# EAGLE design pancake (EAGLE 5.11)
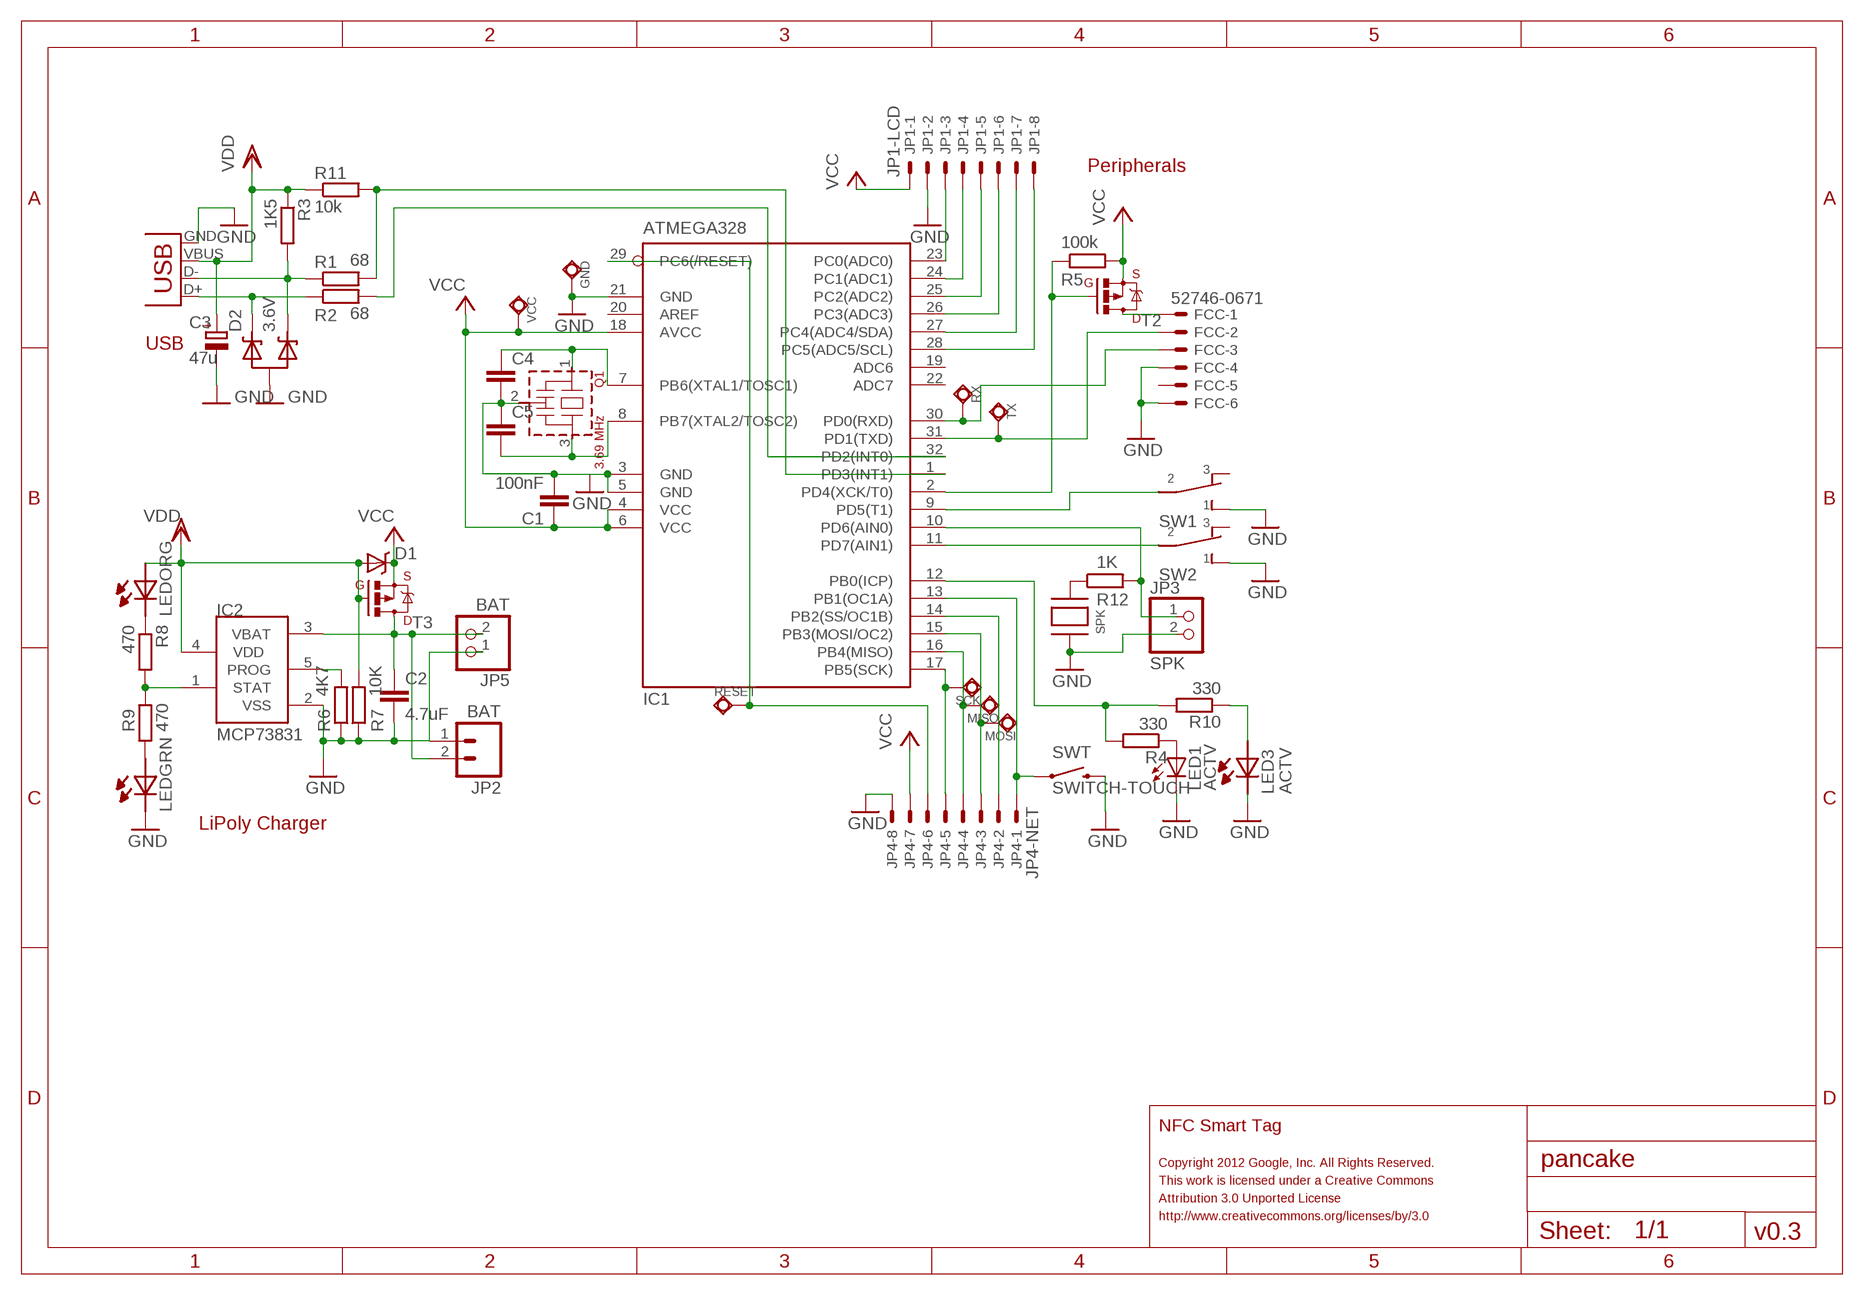
[diagram p0: schematic, sheet 1]

## Parts
C1  100nF  CAP0805  [0805]
C2  4.7uF  C-EUC0805  [C0805]
C3  47u  CPOL-EUCT6032  [CT6032]
C4  CAP0603-CAP  [0603-CAP]
C5  CAP0603-CAP  [0603-CAP]
D1  DIODE-SCHOTTKY  [MCPH3]
D2  3.6V  DIODE-ZENER-DUAL-COMMON-ANODE  [SOT23]
FCC  52746-0671  52745-0690  [52745-0690]
GND  TESTPOINT-BOTTOM  [TP_BOTTOM]
IC1  ATMEGA328  MEGA8-AI  [TQFP32-08]
IC2  MCP73831  [SOT23-5L]
JP1  JP1-LCD  53261-08  [53261-08]
JP2  BAT  M02-JST-2MM-SMT  [S2B-PH]
JP3  SPK  PINHD-1X2  [1X02]
JP4  JP4-NET  53261-08  [53261-08]
JP5  BAT  PINHD-1X2  [1X02]
LED  DUAL_LED  [SML-52]
LED1  ACTV  LEDCHIP-LED0805  [CHIP-LED0805]
LED3  ACTV  CHIPLED_REVERSE  [CHIPLED_1206_REVERSE]
MISO  TESTPOINT-BOTTOM  [TP_BOTTOM]
MOSI  TESTPOINT-BOTTOM  [TP_BOTTOM]
Q1  3.69 MHz  CTSC  [CSTCC_MG]
R1  68  R-EU_R0805  [R0805]
R2  68  R-EU_R0805  [R0805]
R3  1K5  R-EU_R0805  [R0805]
R4  330  R-EU_R0805  [R0805]
R5  100k  R-EU_R0805  [R0805]
R6  4K7  R-EU_R0805  [R0805]
R7  10K  R-EU_R0805  [R0805]
R8  470  R-EU_R0805  [R0805]
R9  470  R-EU_R0805  [R0805]
R10  330  R-EU_R0805  [R0805]
R11  10k  R-EU_R0805  [R0805]
R12  1K  R-EU_R0805  [R0805]
RESET  TESTPOINT-BOTTOM  [TP_BOTTOM]
RX  TESTPOINT-BOTTOM  [TP_BOTTOM]
SCK  TESTPOINT-BOTTOM  [TP_BOTTOM]
SPK  MURATA_BUZZER_SMD  [PKLCS1212]
SW1  SWITCH-CUS-12B  [CUS-12B]
SW2  SWITCH-CUS-12B  [CUS-12B]
SWT  SWITCH-TOUCH  [SWITCH-EVQ11]
T2  MOSFET-PCHANNEL  [SOT23]
T3  MOSFET-PCHANNEL  [SOT23]
TX  TESTPOINT-BOTTOM  [TP_BOTTOM]
USB  USB-MICROB  [USB-MICROB]
VCC  TESTPOINT-BOTTOM  [TP_BOTTOM]

## Nets
D+: D2.2(C2) R2.1 USB.D+
D-: D2.1(C1) R1.1 R3.2 USB.D-
GND: C1.2 C2.2 C3.- C4.2 C5.1 D2.3(A) FCC.4 FCC.6 GND.TP IC1.3(GND) IC1.5(GND) IC1.21(GND) IC2.2(VSS) JP1.2 JP2.1 JP3.2 JP4.8 JP5.1 LED1.C LED3.C(CATHODE) LED.C_GRN(GRN:CATHODE) Q1.2(VSS) R6.1 R7.1 SPK.P$1 SW1.1 SW2.1 SWT.P2 USB.GND
N$1: LED.C_ORG(ORG:CATHODE) R8.1
N$2: LED.A_GRN(GRN:ANODE) R9.1
N$3: FCC.1 T2.3(D)
N$4: LED3.A(ANODE) R10.1
N$5: R12.1 SPK.P$2
N$7: LED1.A R4.1
NFC_POW_CTRL: IC1.2(PD4(XCK/T0)) R5.1 T2.1(G)
PB0: IC1.12(PB0(ICP)) R4.2 R10.2
PB1: IC1.13(PB1(OC1A)) JP4.1 SWT.P1
PB2: IC1.14(PB2(SS/OC1B)) JP4.2
PB3: IC1.15(PB3(MOSI/OC2)) JP4.3 MOSI.TP
PB4: IC1.16(PB4(MISO)) JP4.4 MISO.TP
PB5: IC1.17(PB5(SCK)) JP4.5 SCK.TP
PC0: IC1.23(PC0(ADC0)) JP1.3
PC1: IC1.24(PC1(ADC1)) JP1.4
PC2: IC1.25(PC2(ADC2)) JP1.5
PC3: IC1.26(PC3(ADC3)) JP1.6
PC4: IC1.27(PC4(ADC4/SDA)) JP1.7
PC5: IC1.28(PC5(ADC5/SCL)) JP1.8
PD2: IC1.32(PD2(INT0)) R2.2
PD3: IC1.1(PD3(INT1)) R1.2 R11.2
PD5: IC1.9(PD5(T1)) SW1.2
PD6: IC1.10(PD6(AIN0)) JP3.1 R12.2
PD7: IC1.11(PD7(AIN1)) SW2.2
PROG: IC2.5(PROG) R6.2
RESET: IC1.29(PC6(/RESET)) JP4.6 RESET.TP
RX: FCC.3 IC1.30(PD0(RXD)) RX.TP
STAT: IC2.1(STAT) R8.2 R9.2
TX: FCC.2 IC1.31(PD1(TXD)) TX.TP
VBAT: C2.1 IC2.3(VBAT) JP2.2 JP5.2 T3.3(D)
VCC: C1.1 D1.3(C) IC1.4(VCC) IC1.6(VCC) IC1.18(AVCC) JP1.1 JP4.7 R5.2 T2.2(S) T3.2(S) VCC.TP
VDD: C3.+ D1.1(A) IC2.4(VDD) LED.A_ORG(ORG:ANODE) R3.1 R7.2 R11.1 T3.1(G) USB.VBUS
XTAL1: C4.1 IC1.7(PB6(XTAL1/TOSC1)) Q1.1
XTAL2: C5.2 IC1.8(PB7(XTAL2/TOSC2)) Q1.3
Unconnected: FCC.5 IC1.19(ADC6) IC1.20(AREF) IC1.22(ADC7) SW1.3 SW2.3

## Notes on the sheet
- Peripherals
- USB
- LiPoly Charger
- NFC Smart Tag
- Copyright 2012 Google, Inc. All Rights Reserved.
- This work is licensed under a Creative Commons
- Attribution 3.0 Unported License
- http://www.creativecommons.org/licenses/by/3.0
- v0.3

## Library data of the parts
C1 C4 C5 = SparkFun:CAP: Capacitor Standard 0603 ceramic capacitor, and 0.1" leaded capacitor.
C2 = resistor:C-EU: CAPACITOR, European symbol
C3 = rcl:CPOL-EU: POLARIZED CAPACITOR, European symbol
D1 = sandwich:DIODE-SCHOTTKY
D2 = sandwich:DIODE-ZENER-DUAL-COMMON-ANODE: Dual Zener diode in SOT-23 Package. e.g. AZ23C
FCC = con-molex:52745-0690: FFC/FPC-to-Board 0.50mm (.020") SMT Top Contact Right Angle, ZIF, Style Receptacle 52745 / 52435 Source: http://www.molex.com/product/ffc/52745.html; MPN: 52745-0690; OC_FARNELL: unknown; OC_NEWARK: 92M6374
GND MISO MOSI RESET RX SCK TX VCC = sandwich:TESTPOINT-BOTTOM: Round test point on bototm layer. 1.5mm diameter
IC1 = atmel:MEGA8: MICROCONTROLLER 8 Kbytes FLASH, 1 kbytes SRAM, 512 bytes EEPROM, USART, 6-channel 10 bit ADC, 2-channel 8 bit ADC Pin compatible with Atmega48, ATMega88, ATMega168 Source: avr.lbr; MPN: ATMEGA8-16AU; OC_FARNELL: 9171371; OC_NEWARK: 73M8863
IC2 = microchip-update-2:MCP73831: Miniature Single-Cell, Fully Integrated Li-Ion, Li-Polymer Charge Management Controllers
JP1 JP4 = con-molex:53?-08: CONNECTOR wire to board 1.25 mm (.049 inch) pitch header; OC_FARNELL: 1125376; OC_NEWARK: unknown
JP2 = SparkFun:M02: Header 2 Standard 2-pin 0.1" header. Use with straight break away headers (SKU : PRT-00116), right angle break away headers (PRT-00553), swiss pins (PRT-00743), machine pins (PRT-00117), and female headers (PRT-00115). Molex polarized connector foot print use with SKU : PRT-08233 with associated crimp pins and housings.
JP3 JP5 = pinhead:PINHD-1X2: PIN HEADER
LED = sandwich:DUAL_LED: Rohm Dual Color SML-521MDW
LED1 = led:LED: LED OSRAM: - CHIPLED LG R971, LG N971, LY N971, LG Q971, LY Q971, LO R971, LY R971 LH N974, LH R974 LS Q976, LO Q976, LY Q976 LO Q996 - Hyper CHIPLED LW Q18S LB Q993, LB Q99A, LB R99A - SideLED LS A670, LO A670, LY A670, LG A670, LP A670 LB A673, LV A673, LT A673, LW A673 LH A674 LY A675 LS A676, LA A676, LO A676, LY A676, LW A676 LS A679, LY A679, LG A679 - Hyper Micro SIDELED® LS Y876, LA Y876, LO Y876, LY Y876 LT Y87S - SmartLED LW L88C, LW L88S LB L89C, LB L89S, LG L890 LS L89K, LO L89K, LY L89K LS L896, LA L896, LO L896, LY L896 - TOPLED LS T670, LO T670, LY T670, LG T670, LP T670 LSG T670, LSP T670, LSY T670, LOP T670, LYG T670 LG T671, LOG T671, LSG T671 LB T673, LV T673, LT T673, LW T673 LH T674 LS T676, LA T676, LO T676, LY T676, LB T676, LH T676, LSB T676, LW T676 LB T67C, LV T67C, LT T67C, LS T67K, LO T67K, LY T67K, LW E67C LS E67B, LA E67B, LO E67B, LY E67B, LB E67C, LV E67C, LT E67C LW T67C LS T679, LY T679, LG T679 LS T770, LO T770, LY T770, LG T770, LP T770 LB T773, LV T773, LT T773, LW T773 LH T774 LS E675, LA E675, LY E675, LS T675 LS T776, LA T776, LO T776, LY T776, LB T776 LHGB T686 LT T68C, LB T68C - Hyper Mini TOPLED® LB M676 - Mini TOPLED Santana® LG M470 LS M47K, LO M47K, LY M47K Source: http://www.osram.convergy.de LUXEON: - LUMILED® LXK2-PW12-R00, LXK2-PW12-S00, LXK2-PW14-U00, LXK2-PW14-V00 LXK2-PM12-R00, LXK2-PM12-S00, LXK2-PM14-U00 LXK2-PE12-Q00, LXK2-PE12-R00, LXK2-PE12-S00, LXK2-PE14-T00, LXK2-PE14-U00 LXK2-PB12-K00, LXK2-PB12-L00, LXK2-PB12-M00, LXK2-PB14-N00, LXK2-PB14-P00, LXK2-PB14-Q00 LXK2-PR12-L00, LXK2-PR12-M00, LXK2-PR14-Q00, LXK2-PR14-R00 LXK2-PD12-Q00, LXK2-PD12-R00, LXK2-PD12-S00 LXK2-PH12-R00, LXK2-PH12-S00 LXK2-PL12-P00, LXK2-PL12-Q00, LXK2-PL12-R00 Source: www.luxeon.com KINGBRIGHT: KA-3528ASYC Source: www.kingbright.com
LED3 = sandwich:CHIPLED_REVERSE
Q1 = murata-resonators:CTSC: Murata Resonator 3.50 - 10.00MHz
R1-R12 = resistor:R-EU_: RESISTOR, European symbol
SPK = sandwich:MURATA_BUZZER_SMD
SW1 SW2 = sandwich:SWITCH-CUS-12B: CUS-12B 1P2T SMD Switch RS Part 602-3633
SWT = sandwich:SWITCH-TOUCH: Round Light Touch Switch, e.g. Panasonic EVQ11
T2 T3 = sandwich:MOSFET-PCHANNEL: E.g. IRLML6402
USB = sandwich:USB: USB Connectors USB-B-PTH is fully proven SKU : PRT-00139 USB-miniB is fully proven SKU : PRT-00587 USB-A-PCB is untested. USB-A-H is throughly reviewed, but untested. Spark Fun Electronics SKU : PRT-00437 USB-B-SMT is throughly reviewed, but untested. Needs silkscreen touching up. USB-A-S has not been used/tested USB-MB-H has not been used/tested

## Board
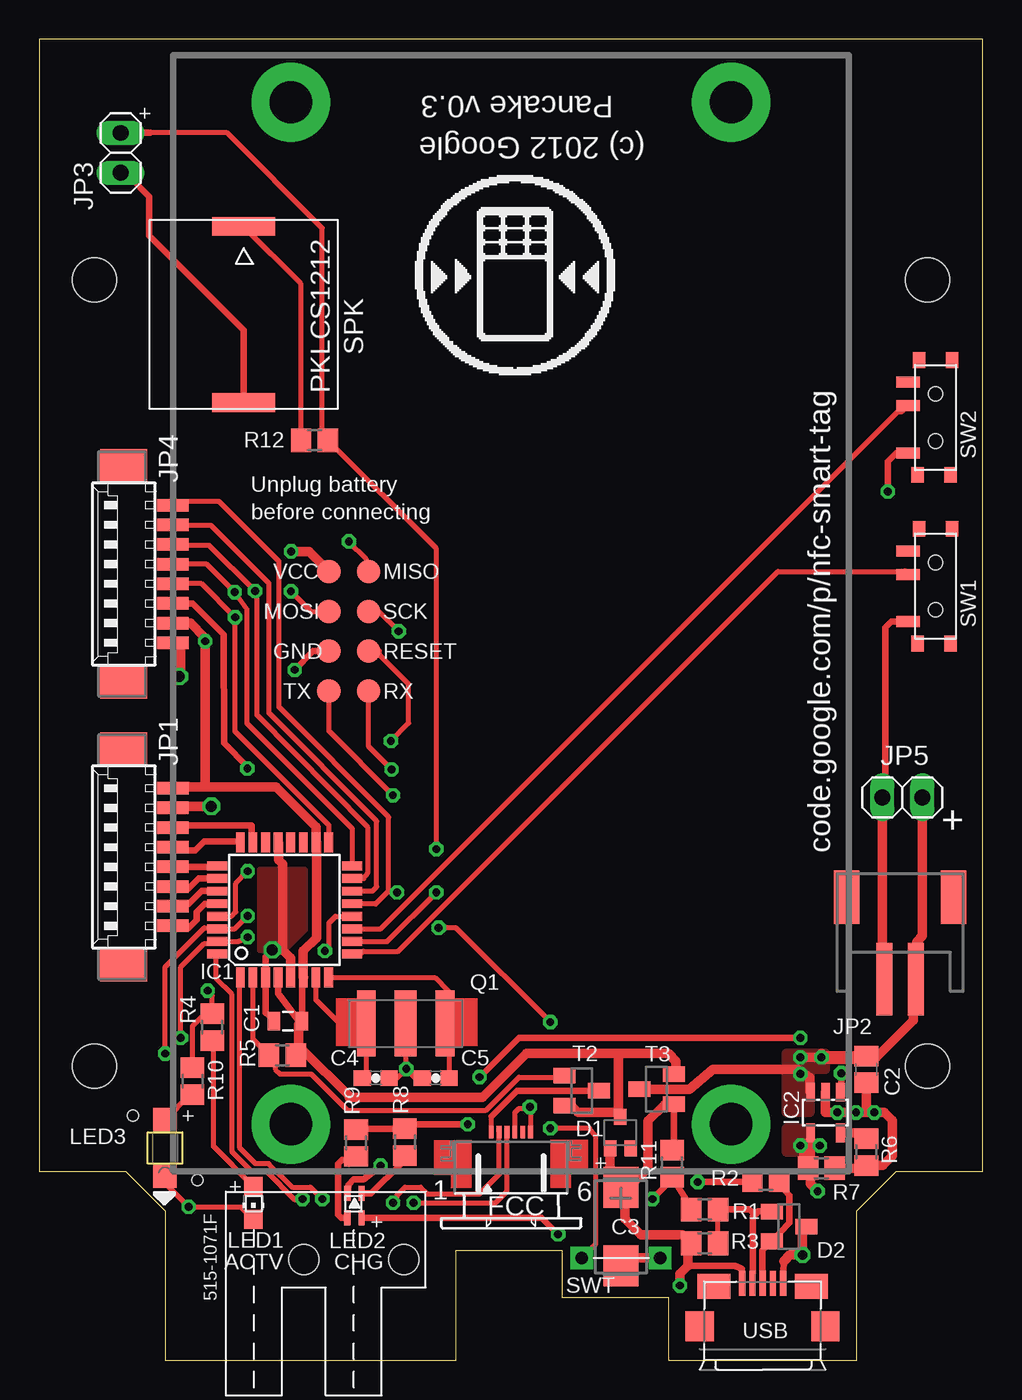
[diagram p1: board, top side]
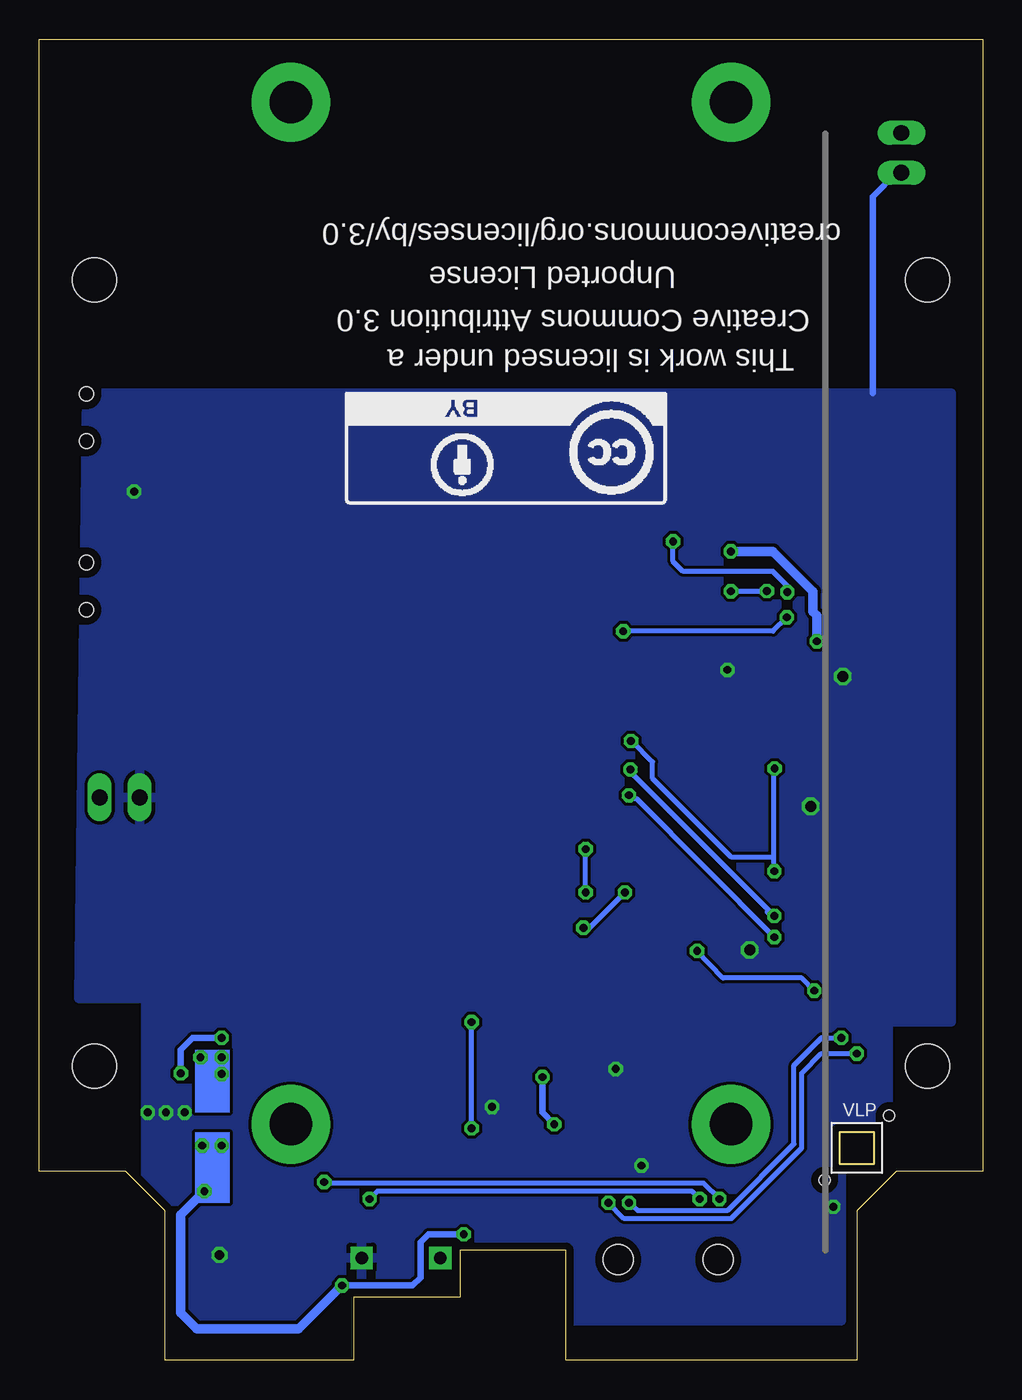
[diagram p2: board, bottom side, seen from below]

Size 60 x 84 mm. Coordinates in mm from the lower left corner, seen from the top.
Outline: 8,9.5 8,0 26.5,0 26.5,7 33.25,7 33.25,4 40,4 40,0 52,0 52,9.5 54.5,12 60,12 60,84 0,84 0,12 5.5,12 8,9.5
Copper layers (1*16): Top 0.035mm / dielectric 1.5mm / Bottom 0.035mm
Design rules "default *": minimum track width 0.3mm, minimum drill 19mil, track to track 5mil, track to pad 5mil, pad to pad 5mil, via to via 5mil, smd to smd 5mil, copper to edge 0.5mm, drill to drill 5mil, minimum pad ring 10mil, minimum via ring 8mil, stop-mask expansion 4mil, vias tented up to drill 0.5mm, thermal gap 10mil
Holes 2.8 mm at 3.5,18.7 56.5,68.7 3.5,68.7 56.5,18.7

### Footprints (pad centres in the part's own frame; a part is rotated, then mirrored left to right if it is on the bottom)
0805 = smd 0.8 x 1.2: 1 -0.9,0; 2 0.9,0
C0805 = smd 1.3 x 1.5: 1 -0.85,0; 2 0.85,0
CT6032 = smd 2.6 x 2.2: + -2.5,0; - 2.5,0
0603-CAP = smd 1.1 x 1: 1 -0.85,0; 2 0.85,0
MCPH3 = smd 0.8 x 1: 1 -0.65,-1; 2 0.65,-1; 3 0,1
SOT23 = smd 1 x 1.4: 1 -0.95,-1.1; 2 0.95,-1.1; 3 0,1.1
52745-0690 = smd 0.3 x 0.8: 1 -1.25,2.5; 2 -0.75,2.5; 3 -0.25,2.5; 4 0.25,2.5; 5 0.75,2.5; 6 1.25,2.5
TP_BOTTOM = smd 1.5 x 1.5 bottom: TP 0,0
TQFP32-08 = smd 1.27 x 0.559: 1 -4.293,2.8; 2 -4.293,2; 3 -4.293,1.2; 4 -4.293,0.4; 5 -4.293,-0.4; 6 -4.293,-1.2; 7 -4.293,-2; 8 -4.293,-2.8; 17 4.293,-2.8; 18 4.293,-2; 19 4.293,-1.2; 20 4.293,-0.4; 21 4.293,0.4; 22 4.293,1.2; 23 4.293,2; 24 4.293,2.8 | smd 0.559 x 1.27: 9 -2.8,-4.293; 10 -2,-4.293; 11 -1.2,-4.293; 12 -0.4,-4.293; 13 0.4,-4.293; 14 1.2,-4.293; 15 2,-4.293; 16 2.8,-4.293; 25 2.8,4.293; 26 2,4.293; 27 1.2,4.293; 28 0.4,4.293; 29 -0.4,4.293; 30 -1.2,4.293; 31 -2,4.293; 32 -2.8,4.293
SOT23-5L = smd 0.55 x 1.2: 1 -0.95,-1.3; 2 0,-1.3; 3 0.95,-1.3; 4 0.95,1.3; 5 -0.95,1.3
53261-08 = smd 0.8 x 2: 1 4.375,-2.5; 2 3.125,-2.5; 3 1.875,-2.5; 4 0.625,-2.5; 5 -0.625,-2.5; 6 -1.875,-2.5; 7 -3.125,-2.5; 8 -4.375,-2.5 | smd 2.1 x 3: S1 6.875,0.625; S2 -6.875,0.625
S2B-PH = smd 1 x 4.6: 1 -1,-3.7; 2 1,-3.7 | smd 1.6 x 3.4: NC1 -3.4,1.5; NC2 3.4,1.5
1X02 = drill 1.016 long: 1 -1.27,0; 2 1.27,0
SML-52 = smd 0.95 x 0.4: A_GRN 0.775,-0.45; A_ORG 0.775,0.45; C_GRN -0.775,-0.45; C_ORG -0.775,0.45
CHIP-LED0805 = smd 1.2 x 1.2: A 0,-1.05; C 0,1.05
CHIPLED_1206_REVERSE = smd 1.5 x 1.5: A 0,-1.8; C 0,1.8
CSTCC_MG = smd 1.2 x 4.2: 1 -2.5,0; 3 2.5,0 | smd 1.4 x 4.2: 2 0,0
R0805 = smd 1.3 x 1.5: 1 -0.85,0; 2 0.85,0
PKLCS1212 = smd 1.2 x 4: P$1 -5.6,0; P$2 5.6,0
CUS-12B = smd 0.7 x 1.5: 1 -2.25,1.75; 2 0.75,1.75; 3 2.25,1.75 | smd 1 x 0.8: P$1 3.65,1.05; P$2 3.65,-1.05; P$3 -3.65,1.15; P$4 -3.65,-0.95 | hole 0.9: 1.5,0; -1.5,0
SWITCH-EVQ11 = drill 0.8 pad 1.422 square: P1 -2.5,0; P2 2.5,0
515-1071F = hole 1.9: 3.175,0; -3.175,0
BIVAR_VLP = hole 0.7: 2.05,2.05; -2.05,-2.05
USB-MICROB = smd 0.4 x 1.6: D+ 0,2.9; D- -0.65,2.9; GND 1.3,2.9; ID 0.65,2.9; VBUS -1.3,2.9 | smd 2.1 x 1.6: GND@1 3.1,2.7; GND@4 -3.1,2.7 | smd 1.8 x 1.9: GND@2 -4,0.15; GND@3 4,0.15

### Placement (x,y rotation side)
C1  15.81,21.57 180 top
C2  52.6,18.5 270 top
C3  36.99,8.5 270 top
C4  21.4,17.95 0 top
C5  25.21,17.95 0 top
D1  36.95,14.47 0 top
D2  47.68,8.51 270 top
FCC  30,12 0.1 top
GND  18.41,45.09 0 bottom
IC1  15.59,28.63 90 top
IC2  50,15.75 180 top
JP1  6,32 90 top
JP2  54.75,27.94 0 top
JP3  5.17,76.78 270 top
JP4  6,50 90 top
JP5  54.9,35.8 0 top
LED  20.05,9.83 270 top
LED1  13.62,10.01 180 top
LED3  8,13.5 180 top
MISO  20.95,50.16 0 bottom
MOSI  18.41,47.62 0 bottom
Q1  23.3,21.41 0 top
R1  42.31,9.59 180 top
R2  46.2,11.46 180 top
R3  42.31,7.43 0 top
R4  11.01,21.18 90 top
R5  15.46,19.39 0 top
R6  52.6,13.24 90 top
R7  49.73,12.21 180 top
R8  23.25,13.88 90 top
R9  20.15,13.81 90 top
R10  9.75,17.75 90 top
R11  40.25,12.5 270 top
R12  17.5,58.5 0 top
RESET  20.95,45.09 0 bottom
RX  20.95,42.55 0 bottom
SCK  20.95,47.62 0 bottom
SPK  13,66.5 90 top
SW1  57,49.22 90 top
SW2  57,59.95 90 top
SWT  37,6.5 0 top
T2  34.5,17.14 270 top
T3  39.26,17.23 90 top
TX  18.41,42.55 0 bottom
U$1  [515-1071F]  20,6.4 0 top
U$2  [BIVAR_VLP]  8,13.5 0 bottom
U$3  [NFC_LOGO_100]  30.25,69 180 top
U$4  [CCBY]  30.25,57.75 180 bottom
USB  46,2 0 top
VCC  18.41,50.16 0 bottom

### Tracks (layer width: path | path; a pad name or v marks a point on that pad's centre or on a via)
D+
  Top 0.406: R2.1 47.05,11.2 47.7,10.5 47.7,8.72 D2.2 46,6.97 USB.D+
D-
  Top 0.305: R3.2 R1.1
  Top 0.406: USB.D- 45.39,6.11 45.39,9.14 45.5,9.25 | 45.5,9.25 45.7,9.46 D2.1 | R1.1 45.16,9.59 45.5,9.25
GND  (via drill 0.48, 0.5, 0.6, 0.7)
  Top 0.3: 18.52,45.09 GND.TP
  Top 0.305: JP5.1 53.91,36.08 | FCC.4 30.25,15.75 30.5,16 31.1,16 v31.2,16.1 31.25,15.65 FCC.6 | LED1.C 12.82,9.75 v9.5,9.75 8,11.25 LED3.C | C5.1 23.91,17.95 v23.34,18.52 | C4.2 22.77,17.95 v23.34,18.52 | v23.34,18.52 23.34,21.36 Q1.2 | C1.2 14.38,22.09
  Top 0.406: 15.97,24.36 IC1.5 | JP1.2 8.21,35.12 | USB.GND 47.34,6.3 | LED.C_GRN 19.66,11.16 20,11.5 20.63,11.5 v21.7,12.37 | v14.82,26.09 14.39,25.66 IC1.3 14.38,24.27 14.38,22.09 | SW2.1 54.52,57.7 53.98,57.15 v53.98,55.24 | SW1.1 54.63,46.97 54.61,46.99 54.19,46.99 53.8,46.6 53.8,35.97 JP5.1 | 18.52,45.09 17.43,45.09 v16.24,43.89 | SPK.P$1 13,65.5 7,71.5 7,74 5.75,75.25 5.42,75.25 JP3.2
  Top 0.61: v14.82,26.09 15.46,26.09 | 15.46,26.09 15.97,25.58 15.97,24.36 | 15.46,26.09 15.46,31.55 15.21,31.8 15.21,32.9 IC1.21 | IC2.2 50,15.75 v51.95,15.75 52.5,15.75 | JP5.1 53.63,24.86 JP2.1 | JP4.8 8.88,45.62 9,45.5 9,43.58 v8.9,43.48 | JP1.2 8.6,35.23 v10.94,35.23 | v53.12,15.75 52.85,15.77 | v53.12,15.75 52.5,15.75 | R6.1 52.6,12.1 | R6.1 53.64,12.39 54.25,13 54.25,15.25 53.75,15.75 v53.12,15.75 | R6.1 52.51,12.3 | D2.3 48.53,8.26 v48.53,6.7 47.73,6.7 47.34,6.3 | C3.- 37.76,6.5 SWT.P2 | R7.1 52.41,12.21 R6.1 | C2.2 52.6,15.85 52.5,15.75
  Bottom 0.406: JP3.2 5.5,75.5 7,74 7,61.5
  other vias: 50.75,15.75
  pour Bottom (isolate 0.2): 53.25,2.5 53.25,23 57.5,23 57,61.5 2,61.5 2,21.5 6,21.5 6,12.5 8.98,12.5 9,3.42 9,2.5
  pour Top: 14.05,31.17 16.86,31.17 16.86,27.36 15.59,26.09 14.05,26.09
N$1
  Top 0.406: LED.C_ORG 21.11,10.61 23,12.5 23,12.78 R8.1
N$2
  Top 0.406: R9.1 19.71,12.5 19.46,12.75 19.25,12.75 19,12.5 19,9.25 19.19,9.06 LED.A_GRN
N$3
  Top 0.305: FCC.1 28.75,15.5
  Top 0.406: T2.3 30.39,17.14 28.75,15.5
N$4
  Top 0.305: R10.1 9.6,16.9 LED3.A
N$5
  Top 0.305: R12.1 16.65,68.45 SPK.P$2
N$7
  Top 0.305: R4.1 11.09,20.25 11.09,13.59 LED1.A
NFC_MOUNT1  (via drill 2.7 pad 5)
  other vias: 16,80
NFC_MOUNT2  (via drill 2.7 pad 5)
  other vias: 44,80
NFC_MOUNT3  (via drill 2.7 pad 5)
  other vias: 44,15
NFC_MOUNT4  (via drill 2.7 pad 5)
  other vias: 16,15
NFC_POW_CTRL
  Top 0.305: T2.1 33.81,18 30.5,18 28.4,15.9 19.6,15.9 17.3,18.2 15.3,18.2 15,18.5 15,19 R5.1 13.59,20.41 IC1.2
  Top 0.406: IC1.2 13.6,24.33
PB0  (via drill 0.5)
  Top 0.305: IC1.12 18.84,28.23 18.41,27.8 18.41,26.28 v18.16,26.03 | v10.7,23.5 11.01,23.2 R4.2 10.53,22.03 9.75,21.25 R10.2
  Bottom 0.305: v18.16,26.03 16.51,24.3 11.51,24.3 v10.7,23.5
PB1  (via drill 0.5)
  Top 0.3: 8.53,54.25 JP4.1
  Top 0.305: IC1.13 19.91,29.06 | 8.53,54.25 8.89,54.61 11.43,54.61 15.24,50.8 15.24,41.53 22.23,34.54 22.23,29.84 | 20.12,29.01 21.39,29.01 22.23,29.84 | v32.5,14.75 35,14.75 35.4,14.25 35.4,7.4 SWT.P1 | v32.5,21.5 26.5,27.5 v25.4,27.5 | v22.75,29.75 22.32,29.75 22.23,29.84
  Top 0.406: 20.12,29.01 IC1.13
  Bottom 0.3: v25.4,27.5 25.4,27.64 25.2,27.64 25.2,27.5
  Bottom 0.305: v32.5,14.75 v32.5,21.5 | 25.25,27.5 25.2,27.5 25,27.5 v22.75,29.75
PB2
  Top 0.3: JP4.2 8.53,53.03
  Top 0.305: JP4.2 8.54,53.09 10.92,53.09 14.61,49.4 14.61,41.15 21.46,34.29 21.46,30.1 21.19,29.83 IC1.14
PB3  (via drill 0.5)
  Top 0.305: JP4.3 8.56,51.82 10.81,51.82 v13.72,48.91 13.84,48.39 13.84,41.02 20.9,33.86 20.9,31 20.63,30.63 IC1.15 | MOSI.TP 17.27,47.62 v16,48.9
  Bottom 0.305: v16,48.9 13.73,48.9 v13.72,48.91
PB4  (via drill 0.5)
  Top 0.3: MISO.TP 20.95,49.96 | IC1.16 19.91,31.57
  Top 0.305: MISO.TP 20.78,50.34 20.78,50.98 v19.68,52.07 | 19.91,31.57 19.91,33.79 13.21,40.5 13.21,47.75 v12.42,48.84 10.63,50.62 JP4.4
  Bottom 0.305: v19.68,52.07 19.68,50.8 19.05,50.16 13.34,50.16 12.32,49.15 v12.42,48.84
PB5  (via drill 0.5)
  Top 0.3: 8.53,49.38 JP4.5
  Top 0.305: 8.53,49.38 10.31,49.38 v12.45,47.24 12.45,39.99 18.41,34.02 18.41,32.95 IC1.17 | SCK.TP 21.59,47.62 v22.86,46.35
  Bottom 0.305: v12.45,47.24 13.34,46.35 v22.86,46.35
PC0
  Top 0.406: JP1.3 8.62,34 13.5,34 13.5,33.01 IC1.23
PC1
  Top 0.406: JP1.4 8.7,32.42 9.92,32.42 10.5,33 12.71,33 IC1.24
PC2
  Top 0.406: JP1.5 11.24,31.38 IC1.25
PC3
  Top 0.406: IC1.26 10.13,30.63 9.5,30 8.62,30 JP1.6
PC4
  Top 0.406: IC1.27 10.33,29.83 9.5,29 8.62,29 JP1.7
PC5
  Top 0.406: IC1.28 10.53,29.03 10,28.5 10,28 9.5,27.5 8.62,27.5 JP1.8
PD2  (via drill 0.5)
  Top 0.305: 11.22,25.75 IC1.32 11.25,25.78 11.25,24.25 12.25,23.25 12.25,13.25 13.5,12 14.45,12 16.25,10.2 16.7,10.2 v16.75,10.25
  Top 0.406: v41.88,11.33 45.23,11.33 R2.2
  Bottom 0.305: v16.75,10.25 17.75,11.25 41.8,11.25 v41.88,11.33
  Bottom 0.406: v41.88,11.33 41.8,11.5
PD3  (via drill 0.5)
  Top 0.305: IC1.1 12.75,24.34 12.75,13.5 13.75,12.5 14.6,12.5 16.1,11 17.25,11 v18,10.25 | 40.25,11.5 R11.2
  Top 0.406: R1.2 41.34,9.59 | R1.2 41.25,9.37 | R11.2 41.5,9.62 R1.2 | R1.2 41.13,9.25 | v39,10.25 40.25,11.5
  Bottom 0.305: v39,10.25 38.5,10.75 18.5,10.75 v18,10.25
PD5
  Top 0.305: 55.05,50.16 46.99,50.16 22.82,26 20.6,26 20.4,25.8 19.91,25.8
  Top 0.406: IC1.9 19.91,25.8 | 55.05,50.16 SW1.2
PD6  (via drill 0.5)
  Top 0.3: IC1.10 19.71,26.49
  Top 0.305: IC1.10 22.13,26.63 v25.25,29.75 | v25.25,32.5 25.25,51.6 R12.2 18,58.85 18,72 11.96,78.05 7.05,78.05
  Top 0.406: 7.05,78.05 JP3.1
  Bottom 0.305: v25.25,29.75 v25.25,32.5
PD7
  Top 0.305: SW2.2 54.88,60.33 54.61,60.33 21.71,27.43 IC1.11
  Top 0.406: SW2.2
PROG
  Top 0.61: IC2.5 52.24,14.45 R6.2
RESET  (via drill 0.5)
  Top 0.305: IC1.29 12.23,28.23 12.5,28.5 12.5,30.31 v13.25,31.1 | 21.59,45.09 RESET.TP | 21.59,44.91 23.5,43 23.5,40.51 v22.36,39.37
  Top 0.406: JP4.6 9.74,48.12 11.73,46.13 11.75,39.25 13.23,37.77 v13.23,37.63 | 21.59,44.91 21.59,45.09
  Bottom 0.305: v13.25,31.1 13.29,31.98 | 13.29,31.98 13.29,37.08 v13.23,37.63 | 13.29,31.98 15.98,31.98 21,37 21,38.05 22.32,39.37 v22.36,39.37
RX  (via drill 0.48, 0.5)
  Top 0.3: RX.TP 20.95,42.44
  Top 0.305: v13.25,28.25 12.43,27.43 IC1.30 11.23,27.5 10.5,27.5 8,25 v8,19.5 | 20.95,41.91 20.95,39.01 v22.4,37.57 | FCC.3 29.75,10.75 29,10 v23.8,10
  Top 0.406: IC1.30 11.23,27.36 | 20.95,41.91 RX.TP
  Bottom 0.305: 22.23,37.39 22.23,37.23 v13.25,28.25 | v8,19.5 10.25,19.5 11.5,18.25 11.5,13.5 16,9 22.8,9 v23.8,10
  Bottom 0.406: v13.25,28.25 13.66,28.5 | 22.23,37.39 v22.4,37.57
STAT  (via drill 0.5)
  Top 0.406: R9.2 19.81,14.72 R8.2 23.52,15 v27.25,15 | v28,18 30.5,20.5 v48.4,20.5 | v51,18.25 51,17.1 IC2.1
  Bottom 0.406: v28,18 28,15.75 v27.25,15 | v51,18.25 51,19.75 50.25,20.5 v48.4,20.5
TX  (via drill 0.48, 0.5)
  Top 0.3: TX.TP 18.31,42.65
  Top 0.305: v13.25,26.9 12.63,26.63 IC1.31 11.17,26.5 10.5,26.5 9,25 v9,20.5 | v22.5,35.92 18.41,40.01 TX.TP | FCC.2 29.25,11.81 28,10.56 24.68,10.56 24.25,11 23.25,11 22.75,10.5 22.75,10.25 v22.5,10
  Top 0.406: 18.31,42.65 18.31,42.44
  Bottom 0.305: v22.5,10 21.93,9.5 16.25,9.5 12,13.75 12,18.75 10.25,20.5 v9,20.5 | v13.25,26.9 22,35.7 22.27,35.7 v22.5,35.92
VBAT  (via drill 0.5)
  Top 0.3: 55.8,24.19 55.68,24.38 JP2.2 55.88,24.59 55.8,24.79
  Top 0.61: 49,17.1 49,18 48.25,18.5 42.85,18.5 41.34,17.23 T3.3 | JP5.2 56.17,26.97 55.8,26.6 55.8,24.79 | 53,19.5 C2.1 52.7,19.25 53.25,19.25 55.6,21.6 55.6,22.4 55.8,22.6 55.8,24.19 | JP2.2 55.8,24.69 | 49.75,19.5 v49.75,19.25 v48.4,19.25
  Top 0.813: v49.75,19.25 52.51,19.25 C2.1
  other vias: 48.4,18.2
  pour Top (no thermals): 49,15.75 49,18.5 50,18.5 50,19.5 47.5,19.5 47.5,15.75
VCC  (via drill 0.5)
  Top 0.3: 10.57,45.72 v10.54,45.72 10.5,45.72
  Top 0.305: R5.2 16.39,19.39 16.75,19.75
  Top 0.406: IC1.4 15.19,23.31 16.71,21.29 C1.1 16.71,24.26 IC1.6
  Top 0.61: IC1.6 16.79,26.02 17.62,26.85 17.62,32.95 IC1.18 17.59,33.91 15.05,36.45 10.29,36.45 | JP1.1 8.62,36.5 9.5,36.5 9.55,36.45 10.29,36.45 | JP4.7 9.62,46.88 10.5,46 10.5,45.72 | v16.01,51.44 17.14,51.44 VCC.TP | v10.54,45.72 10.54,36.7 10.29,36.45 | T3.2 40.5,18.33 40.5,19 40,19.5 36.75,19.5 | 36.75,19.5 31,19.5 28.2,16.7 19.7,16.7 19.7,16.8 16.75,19.75 16.5,20 16.5,21.36 C1.1 | 36.75,19.5 36.85,19.4 36.85,15.65 36.95,15.54 D1.3 36.67,15.75 34.25,15.75 33.9,16.1 33.49,16.1 T2.2
  Bottom 0.305: v10.54,45.72 10.54,46.1
  Bottom 0.61: 10.54,46.1 10.54,47.37 10.79,47.62 10.79,48.9 13.34,51.44 v16.01,51.44
VDD  (via drill 0.5)
  Top 0.3: R11.1 40.23,13.41 40.35,13.46 | R3.1 41.45,7.32 41.25,7.21
  Top 0.305: 44.7,5.8 USB.VBUS
  Top 0.406: v40.75,4.75 40.72,5.21 | 44.7,5.8 44.25,6 41.25,6 | IC2.4 49.05,13.5 49.05,13.36 | T3.1 40.35,13.46 | LED.A_ORG 31.94,9.06 v33,8 | R3.1 41.91,7.99 | 37.25,9.75 37.25,10.25 37.25,10.48 C3.+
  Top 0.61: T3.1 40.32,16.25 39.75,16.25 38.72,15.21 38.72,12.21 37.5,11 C3.+ 36.52,11.48 36.25,11.48 36.25,11.75 36.3,11.8 D1.1 | R7.2 48.63,13.09 49.05,13.5 49.05,11.2 v49.5,10.75 | v40.75,4.75 40.75,5.5 41.25,6 41.25,7.21 | 37.25,10.25 37.25,9 38.27,7.99 40.91,7.99 R3.1
  Top 0.813: v49.65,13.65 v48.4,13.65
  Bottom 0.406: v33,8 35.25,8 35.75,7.5 35.75,5.25 36.25,4.75 v40.75,4.75
  Bottom 0.61: v49.5,10.75 51,9.25 51,3 50,2 43.5,2 v40.75,4.75
  pour Top (no thermals): 49,14.75 47.5,14.75 47.5,13.25 49,13.25
XTAL1
  Top 0.305: 17.6,24.33 IC1.7 17.59,22.91 19,21.5 20.7,21.5 Q1.1 20.8,18.2 C4.1
  Top 0.406: IC1.7 17.5,24.25
XTAL2
  Top 0.305: C5.2 26.06,21.14 Q1.3 26,21.61 26,23.5 25.16,24.34 IC1.8
(copper drawn outside any net)
  shapes: Bottom area x2, Top area x2

### Text on the board
tPlace: Pancake v0.3 | (c) 2012 Google | Unplug battery | before connecting | code.google.com/p/nfc-smart-tag
bPlace: creativecommons.org/licenses/by/3.0 | Unported License | Creative Commons Attribution 3.0 | This work is licensed under a
tNames: + | + | + | + | + | 1 | 6 | + | LED2 | ACTV | CHG